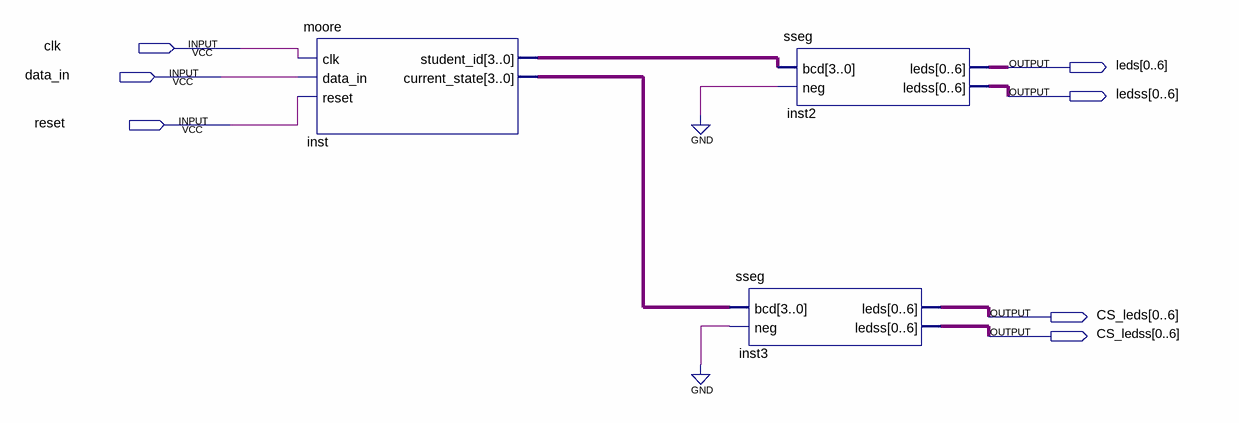
[diagram p0: schematic sheet]
// Quartus schematic blockMoore.bdf as structural Verilog: 3 symbols, 7 pins
module blockMoore (
  input  clk,
  input  data_in,
  input  reset,
  output [0:6] leds,
  output [0:6] ledss,
  output [0:6] CS_leds,
  output [0:6] CS_ledss
);

  wire [3:0] inst_current_state, inst_student_id;

  moore inst (
    .clk(clk), .data_in(data_in), .reset(reset), .student_id(inst_student_id),
    .current_state(inst_current_state));
  sseg inst3 (.bcd(inst_current_state), .neg(1'b0), .leds(CS_leds), .ledss(CS_ledss));
  sseg inst2 (.bcd(inst_student_id), .neg(1'b0), .leds(leds), .ledss(ledss));
endmodule
